# EAGLE board proto (EAGLE 5.10)
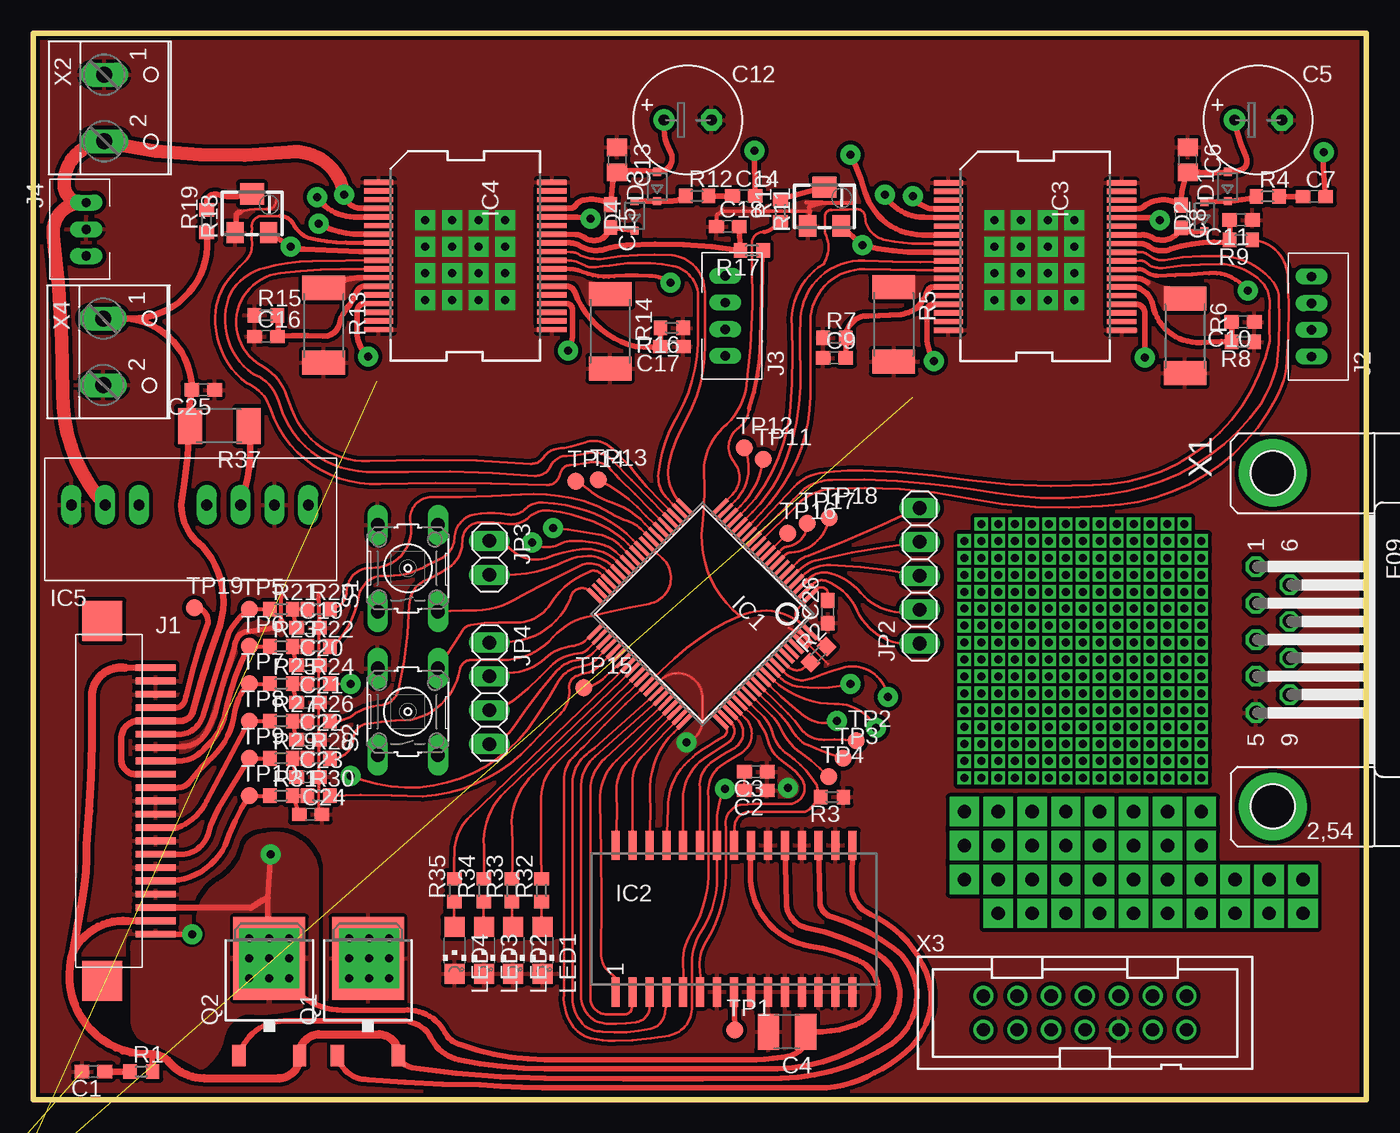
[diagram p2: board, top side]
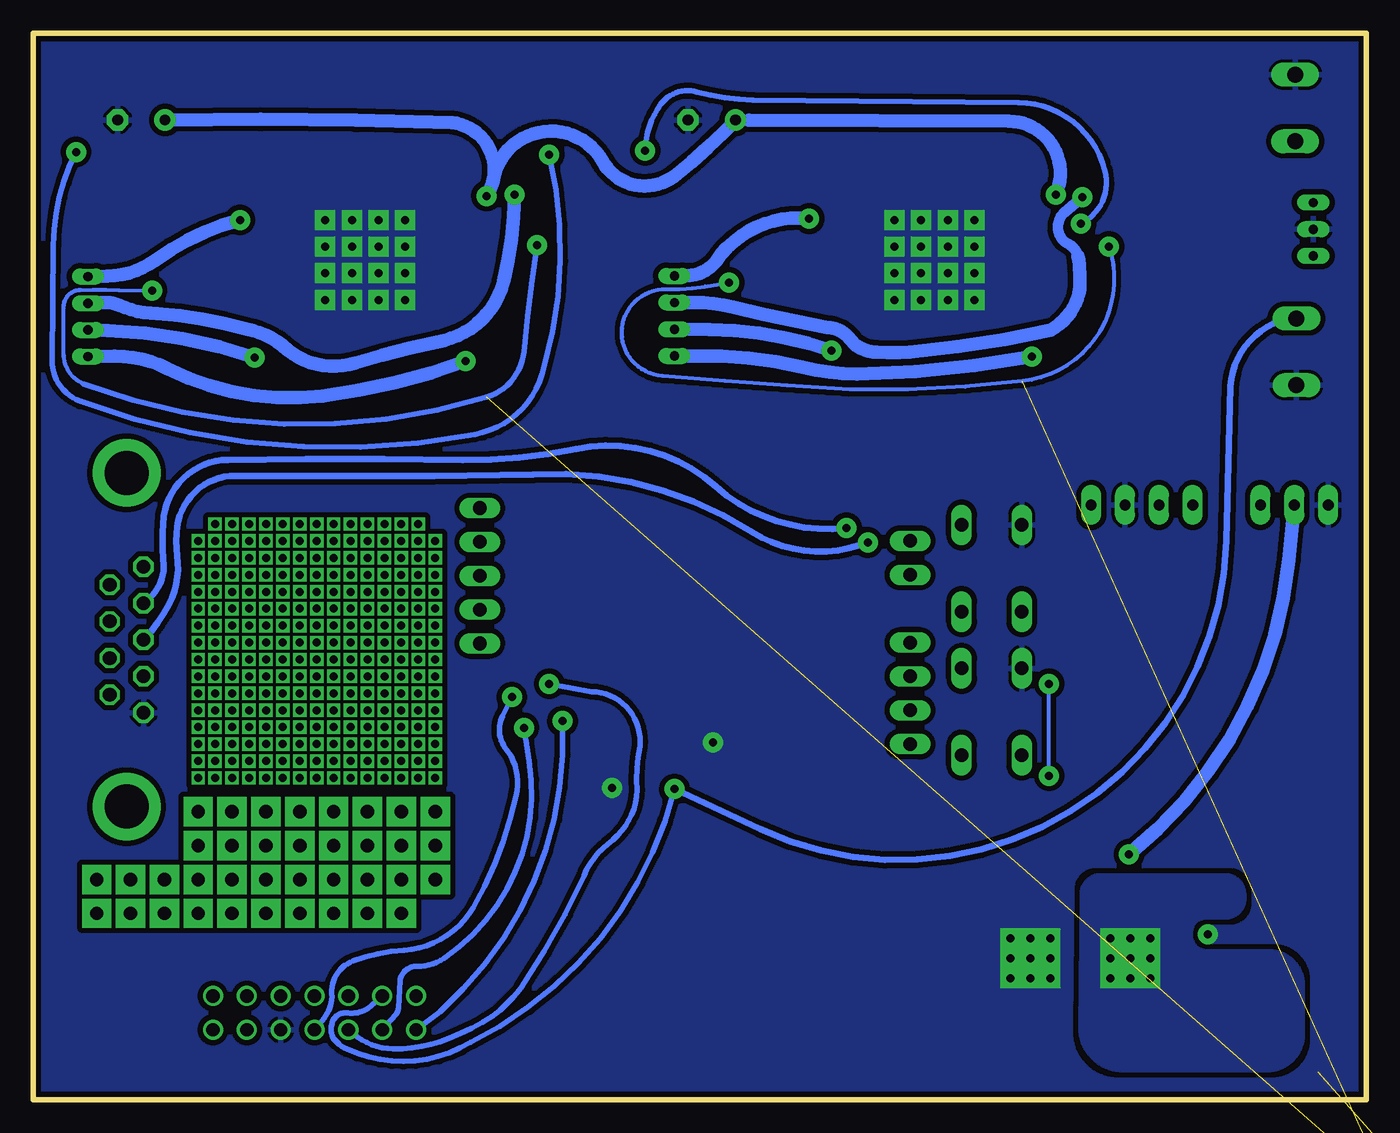
[diagram p3: board, bottom side, seen from below]

Size 100 x 80 mm. Coordinates in mm from the lower left corner, seen from the top.
Outline: 0,0 100,0 100,80 0,80 0,0
Copper layers (1*16): Top 0.035mm / dielectric 1.5mm / Bottom 0.035mm
Design rules "pcbtrain-express": minimum track width 0.2mm, minimum drill 0.5mm, track to track 0.2mm, track to pad 0.2mm, pad to pad 0.2mm, via to via 0.2mm, smd to smd 0.15mm, copper to edge 0.25mm, drill to drill 8mil, minimum pad ring 10mil, minimum via ring 8mil, stop-mask expansion 0.125mm, vias tented up to drill 0mil, thermal gap 10mil

## Footprints (pad centres in the part's own frame; a part is rotated, then mirrored left to right if it is on the bottom)
C0603 = smd 1.1 x 1: 1 -0.85,0; 2 0.85,0
C1210 = smd 1.6 x 2.7: 1 -1.4,0; 2 1.4,0
E3,5-8 = drill 0.813 pad 1.6 round: + -1.778,0 | drill 0.813 pad 1.6 octagon: - 1.778,0
C0805 = smd 1.3 x 1.5: 1 -0.95,0; 2 0.95,0
SOD323-R = smd 0.6 x 0.6: A 1.1,0; C -1.1,0
SQFP-S-12X12-80 = smd 0.3 x 1.6: 1 -4.75,-6.6; 2 -4.25,-6.6; 3 -3.75,-6.6; 4 -3.25,-6.6; 5 -2.75,-6.6; 6 -2.25,-6.6; 7 -1.75,-6.6; 8 -1.25,-6.6; 9 -0.75,-6.6; 10 -0.25,-6.6; 11 0.25,-6.6; 12 0.75,-6.6; 13 1.25,-6.6; 14 1.75,-6.6; 15 2.25,-6.6; 16 2.75,-6.6; 17 3.25,-6.6; 18 3.75,-6.6; 19 4.25,-6.6; 20 4.75,-6.6; 41 4.75,6.6; 42 4.25,6.6; 43 3.75,6.6; 44 3.25,6.6; 45 2.75,6.6; 46 2.25,6.6; 47 1.75,6.6; 48 1.25,6.6; 49 0.75,6.6; 50 0.25,6.6; 51 -0.25,6.6; 52 -0.75,6.6; 53 -1.25,6.6; 54 -1.75,6.6; 55 -2.25,6.6; 56 -2.75,6.6; 57 -3.25,6.6; 58 -3.75,6.6; 59 -4.25,6.6; 60 -4.75,6.6 | smd 1.6 x 0.3: 21 6.6,-4.75; 22 6.6,-4.25; 23 6.6,-3.75; 24 6.6,-3.25; 25 6.6,-2.75; 26 6.6,-2.25; 27 6.6,-1.75; 28 6.6,-1.25; 29 6.6,-0.75; 30 6.6,-0.25; 31 6.6,0.25; 32 6.6,0.75; 33 6.6,1.25; 34 6.6,1.75; 35 6.6,2.25; 36 6.6,2.75; 37 6.6,3.25; 38 6.6,3.75; 39 6.6,4.25; 40 6.6,4.75; 61 -6.6,4.75; 62 -6.6,4.25; 63 -6.6,3.75; 64 -6.6,3.25; 65 -6.6,2.75; 66 -6.6,2.25; 67 -6.6,1.75; 68 -6.6,1.25; 69 -6.6,0.75; 70 -6.6,0.25; 71 -6.6,-0.25; 72 -6.6,-0.75; 73 -6.6,-1.25; 74 -6.6,-1.75; 75 -6.6,-2.25; 76 -6.6,-2.75; 77 -6.6,-3.25; 78 -6.6,-3.75; 79 -6.6,-4.25; 80 -6.6,-4.75
SOP30 = smd 0.6 x 2.2: 1 -8.89,-5.5; 2 -7.62,-5.5; 3 -6.35,-5.5; 4 -5.08,-5.5; 5 -3.81,-5.5; 6 -2.54,-5.5; 7 -1.27,-5.5; 8 0,-5.5; 9 1.27,-5.5; 10 2.54,-5.5; 11 3.81,-5.5; 12 5.08,-5.5; 13 6.35,-5.5; 14 7.62,-5.5; 15 8.89,-5.5; 16 8.89,5.5; 17 7.62,5.5; 18 6.35,5.5; 19 5.08,5.5; 20 3.81,5.5; 21 2.54,5.5; 22 1.27,5.5; 23 0,5.5; 24 -1.27,5.5; 25 -2.54,5.5; 26 -3.81,5.5; 27 -5.08,5.5; 28 -6.35,5.5; 29 -7.62,5.5; 30 -8.89,5.5
POWERSO-36 = smd 0.4 x 2.2: 1 -5.525,-6.5; 2 -4.875,-6.5; 3 -4.225,-6.5; 4 -3.575,-6.5; 5 -2.925,-6.5; 6 -2.275,-6.5; 7 -1.625,-6.5; 8 -0.975,-6.5; 9 -0.325,-6.5; 10 0.325,-6.5; 11 0.975,-6.5; 12 1.625,-6.5; 13 2.275,-6.5; 14 2.925,-6.5; 15 3.575,-6.5; 16 4.225,-6.5; 17 4.875,-6.5; 18 5.525,-6.5; 19 5.525,6.5; 20 4.875,6.5; 21 4.225,6.5; 22 3.575,6.5; 23 2.925,6.5; 24 2.275,6.5; 25 1.625,6.5; 26 0.975,6.5; 27 0.325,6.5; 28 -0.325,6.5; 29 -0.975,6.5; 30 -1.625,6.5; 31 -2.275,6.5; 32 -2.925,6.5; 33 -3.575,6.5; 34 -4.225,6.5; 35 -4.875,6.5; 36 -5.525,6.5
IU-SIP = drill 0.8 pad 1.5 long: 1 -8.7,-1.04; 2 -6.16,-1.04; 3 -3.62,-1.04; 5 1.46,-1.04; 6 4,-1.04; 7 6.54,-1.04; 8 9.08,-1.04
FFC-21 = smd 3 x 0.5: 1 4,9.5; 2 4,8.5; 3 4,7.5; 4 4,6.5; 5 4,5.5; 6 4,4.5; 7 4,3.5; 8 4,2.5; 9 4,1.5; 10 4,0.5; 11 4,-0.5; 12 4,-1.5; 13 4,-2.5; 14 4,-3.5; 15 4,-4.5; 16 4,-5.5; 17 4,-6.5; 18 4,-7.5; 19 4,-8.5; 20 4,-9.5; 21 4,-10.5 | smd 3 x 3: P$1 0,-14; P$2 0,13
4-WAY-2MM = drill 0.7 long: 1 -3,0.5; 2 -1,0.5; 3 1,0.5; 4 3,0.5
3-WAY-2MM = drill 0.7 long: 1 -2,0.27; 2 0,0.27; 3 2,0.27
1X05 = drill 1.016 long: 1 -5.08,0; 2 -2.54,0; 3 0,0; 4 2.54,0; 5 5.08,0
1X02 = drill 1.016 long: 1 -1.27,0; 2 1.27,0
1X04 = drill 1.016 long: 1 -3.81,0; 2 -1.27,0; 3 1.27,0; 4 3.81,0
CHIPLED_1206 = smd 1.5 x 1.5: A 0,-1.75; C 0,1.75
DPACK_1 = smd 1 x 1.6: B -2.28,-4.8; E 2.28,-4.8 | smd 5.4 x 6.2: C 0,2.5
R0603 = smd 1 x 1.1: 1 -0.85,0; 2 0.85,0
R2512 = smd 1.8 x 3.2: 1 -2.8,0; 2 2.8,0
RTRIMTSM53YJ = smd 1.3 x 1.6: 1 -1.25,-1.45; 2 1.25,-1.45 | smd 1.8 x 1.6: 3 0,1.45
R2010 = smd 1.8 x 2.7: 1 -2.2,0; 2 2.2,0
B3F-10XX = drill 1.016 long: 1 -3.251,2.261; 2 3.251,2.261; 3 -3.251,-2.261; 4 3.251,-2.261
B1,27 = smd 1.27 x 1.27: TP 0,0
F09HP = drill 1.016 octagon: 1 -5.486,-1.27; 2 -2.743,-1.27; 3 0,-1.27; 4 2.743,-1.27; 5 5.486,-1.27; 6 -4.115,1.27; 7 -1.372,1.27; 8 1.372,1.27; 9 4.115,1.27 | drill 3.302 pad 5.08 round: G1 -12.522,0; G2 12.522,0
W237-102 = drill 1.194 long: 1 -2.5,-1.27; 2 2.5,-1.27
PAK100/2500-14 = drill 1 pad 1.422 round: 1 -7.62,-1.27; 2 -7.62,1.27; 3 -5.08,-1.27; 4 -5.08,1.27; 5 -2.54,-1.27; 6 -2.54,1.27; 7 0,-1.27; 8 0,1.27; 9 2.54,-1.27; 10 2.54,1.27; 11 5.08,-1.27; 12 5.08,1.27; 13 7.62,-1.27; 14 7.62,1.27

## Placement (x,y rotation side)
C1  15nF  [C0603]  4.5,2.1 180 top
C2  1nF  [C0603]  54.2,23.2 180 top
C3  100nF  [C0603]  54.2,24.6 180 top
C4  10uF 50V  [C1210]  56.55,5.1 180 top
C5  100uF  [E3,5-8]  91.9,73.5 0 top
C6  100nF  [C0805]  86.6,70.5 270 top
C7  10nF  [C0603]  96.1,67.75 0 top
C8  220nF  [C0603]  86.1,66.25 270 top
C9  1nF  [C0603]  60.1,55.65 0 top
C10  1nF  [C0603]  90.75,58.35 180 top
C11  5.6nF  [C0603]  90.6,66 180 top
C12  100uF  [E3,5-8]  49.1,73.5 0 top
C13  100nF  [C0805]  43.8,70.5 270 top
C14  10nF  [C0603]  53.3,67.8 0 top
C15  220nF  [C0603]  43.3,66.3 270 top
C16  1nF  [C0603]  17.45,57.25 0 top
C17  1nF  [C0603]  47.9,56.5 180 top
C18  5.6nF  [C0603]  52.1,65.5 0 top
C19  100pF  [C0603]  20.6,35.4 0 top
C20  100pF  [C0603]  20.6,32.6 0 top
C21  100pF  [C0603]  20.6,29.8 0 top
C22  100pF  [C0603]  20.6,27 0 top
C23  100pF  [C0603]  20.6,24.2 0 top
C24  100pF  [C0603]  20.8,21.4 0 top
C25  100nF  [C0603]  12.75,53.25 180 top
C26  100nF  [C0603]  59.6,36.6 90 top
C27  68nF  [C0603]  -6.35,-10.16 0 top  (outside the outline)
C28  68nF  [C0603]  -6.35,-15.24 0 top  (outside the outline)
D1  1N4148WS  [SOD323-R]  89.6,68.5 90 top
D2  1N4148WS  [SOD323-R]  87.85,66.25 90 top
D3  1N4148WS  [SOD323-R]  46.8,68.5 90 top
D4  1N4148WS  [SOD323-R]  45.1,66.3 90 top
IC1  MSP430F2618TPN  [SQFP-S-12X12-80]  50.21,36.43 135 top
IC2  E09A41RA  [SOP30]  52.57,13.57 0 top
IC3  L6228PD  [POWERSO-36]  75.15,63.25 270 top
IC4  L6228PD  [POWERSO-36]  32.4,63.3 270 top
IC5  IU4803SA  [IU-SIP]  11.55,45.65 0 top
J1  FFC-21  [FFC-21]  5.17,22.91 0 top
J2  [4-WAY-2MM]  96.4,58.75 90 top
J3  [4-WAY-2MM]  52.4,58.8 90 top
J4  PINHD-1X3-2MM  [3-WAY-2MM]  3.7,65.3 270 top
JP2  [1X05]  66.5,39.3 90 top
JP3  [1X02]  34.22,40.64 270 top
JP4  [1X04]  34.22,30.48 270 top
LED1  [CHIPLED_1206]  38.2,11.2 180 top
LED2  [CHIPLED_1206]  36,11.2 180 top
LED3  [CHIPLED_1206]  33.8,11.2 180 top
LED4  [CHIPLED_1206]  31.6,11.2 180 top
Q1  2SA2192  [DPACK_1]  25.1,8.1 0 top
Q2  2SC6017  [DPACK_1]  17.7,8.1 0 top
R1  2R2  [R0603]  8.1,2.1 0 top
R2  1k  [R0603]  58.9,33.4 45 top
R3  1k  [R0603]  59.93,22.69 180 top
R4  100R  [R0603]  92.6,67.75 0 top
R5  560mR  [R2512]  64.55,58.17 270 top
R6  560mR  [R2512]  86.4,57.3 270 top
R7  39k  [R0603]  60.1,57.15 0 top
R8  39k  [R0603]  90.75,56.85 180 top
R9  100k  [R0603]  90.6,64.5 180 top
R10  27k  [R0603]  56.05,66.7 90 top
R11  10k  [RTRIMTSM53YJ]  59.35,67 0 top
R12  100R  [R0603]  49.8,67.8 0 top
R13  560mR  [R2512]  21.77,58.1 270 top
R14  560mR  [R2512]  43.27,57.65 270 top
R15  39k  [R0603]  17.45,58.85 0 top
R16  39k  [R0603]  47.9,57.9 180 top
R17  100k  [R0603]  53.9,63.7 180 top
R18  10k  [RTRIMTSM53YJ]  16.4,66.5 0 top
R19  27k  [R0603]  13,65.9 90 top
R20  100R  [R0603]  21.4,36.8 0 top
R21  100R  [R0603]  18.6,36.8 0 top
R22  100R  [R0603]  21.4,34 0 top
R23  100R  [R0603]  18.6,34 0 top
R24  100R  [R0603]  21.4,31.2 0 top
R25  100R  [R0603]  18.6,31.2 0 top
R26  100R  [R0603]  21.4,28.4 0 top
R27  100R  [R0603]  18.6,28.4 0 top
R28  100R  [R0603]  21.4,25.6 0 top
R29  100R  [R0603]  18.6,25.6 0 top
R30  100R  [R0603]  21.4,22.8 0 top
R31  100R  [R0603]  18.6,22.8 0 top
R32  150R  [R0603]  38.13,15.71 90 top
R33  150R  [R0603]  35.91,15.71 90 top
R34  150R  [R0603]  33.8,15.71 90 top
R35  150R  [R0603]  31.58,15.71 90 top
R37  LINK  [R2010]  13.95,50.55 180 top
S1  [B3F-10XX]  28.1,39.86 90 top
S2  [B3F-10XX]  28.1,29.1 90 top
TP1  TPB1,27  [B1,27]  52.63,5.21 0 top
TP2  TPB1,27  [B1,27]  61.75,26.91 0 top
TP3  TPB1,27  [B1,27]  60.77,25.61 0 top
TP4  TPB1,27  [B1,27]  59.69,24.21 0 top
TP5  TPB1,27  [B1,27]  16.2,36.8 0 top
TP6  TPB1,27  [B1,27]  16.2,34 0 top
TP7  TPB1,27  [B1,27]  16.2,31.2 0 top
TP8  TPB1,27  [B1,27]  16.2,28.4 0 top
TP9  TPB1,27  [B1,27]  16.2,25.6 0 top
TP10  TPB1,27  [B1,27]  16.2,22.8 0 top
TP11  TPB1,27  [B1,27]  54.75,48.05 0 top
TP12  TPB1,27  [B1,27]  53.35,48.9 0 top
TP13  TPB1,27  [B1,27]  42.4,46.5 0 top
TP14  TPB1,27  [B1,27]  40.7,46.4 0 top
TP15  TPB1,27  [B1,27]  41.3,30.9 0 top
TP16  TPB1,27  [B1,27]  56.6,42.5 0 top
TP17  TPB1,27  [B1,27]  58.05,43.25 0 top
TP18  TPB1,27  [B1,27]  59.7,43.65 0 top
TP19  TPB1,27  [B1,27]  12.1,36.9 0 top
X1  [F09HP]  93,34.5 270 top
X2  [W237-102]  6.6,74.4 270 top
X3  2514-  [PAK100/2500-14]  78.9,6.5 0 top
X4  [W237-102]  6.5,56.1 270 top

## Tracks (layer width: path | path; a pad name or v marks a point on that pad's centre or on a via)
!RST
  Top 0.2: IC2.6 arc9 50,9.7 arc-37 50.5,11.9 arc31 51.95,16.9 51.95,20.45 arc-83 53,22.1 arc-9 54.7,22.2 arc3 56.9,22.2 arc110 57.7,24 arc22 56.3,25.3 arc-38 55.2,26.7 arc21 54.4,28.4 IC1.65
+3V3  (via drill 0.6 pad 1.5)
  Top 0.2: 53,36.3 arc19 48.1,33.1 IC1.52 arc4 41.3,26.5 arc-4 40.6,25.8 arc46 39.8,24 39.8,7.9 arc34 40.4,5.6 arc41 41.8,4.6 arc15 43.6,4.4 arc11 47.7,4.8 arc83 49.4,7 49.4,10.2 arc-33 50.1,12.6 arc27 51.3,16.1 IC2.24 51.3,20.5 arc-34 v51.9,23.3 C2.2 C3.2 | 53,36.3 arc-73 IC1.80 | IC1.80 arc16 57.5,35.8 arc-100 57.4,36.9 IC1.1 arc0 58.8,38.3 arc-130 59.6,38 arc-8 C26.2 | R2.2 59.5,34.1 arc53 59.7,34.2 arc-49 58.7,34.7 arc17 IC1.80 | 54.8,65.1 arc90 53.9,64.2 53.9,62.8 arc-11 53.45,53.27 arc-35 52.05,50.67 arc50 50.3,47.2 arc-11 50.2,43.1 arc58 53,36.3
  Top 0.3: R10.1 55.5,65.4 arc-32 54.8,65.1
  Top 0.4: 11.7,50.2 arc30 R37.2
  Top 0.5: J1.9 arc-90 J1.9 7.7,24.4 arc-90 6.6,25.5 6.6,27.1 arc-90 7.91,28.41 J1.5 arc-1 10.9,28.4 arc84 12,29.2 arc-7 14,35.6 arc58 12.7,41.5 arc-54 11.1,44.6 arc7 11.7,50.2 | R37.2 arc-20 C25.2 arc91 6.6,58.6 | 6.6,58.6 X4.1 | 6.6,58.6 7.4,58.6 arc98 R19.1
  Bottom 0.3: v51.9,23.3 51.9,22.7
  Bottom 0.4: X3.4 74.7,7 arc50 76.4,6.5 arc-84 77.6,5.7 arc-43 77.5,4.6 arc-28 76.5,3.8 arc-57 67.2,4.3 arc-50 v51.9,23.3
  Bottom 0.5: v51.9,23.3 45.5,20.3 arc-114 10.5,41.9 10.2,53.5 arc77 5.4,58.7 arc146 X4.1
CH
  Top 0.3: TP6.TP R23.1
  Top 0.4: J1.8 10.9,25.4 arc51 12.8,26.3 arc34 14.3,28.6 arc-13 15.6,32.8 arc-2 TP6.TP
CH_M
  Top 0.2: IC1.30 45,42 arc31 40.8,44.4 arc11 38.2,44.8 arc49 36.9,44.3 arc-56 35.6,43.9 arc22 33.1,43.9 arc78 31.6,42.1 arc-60 30.6,40.6 arc1 29.2,39.9 arc-31 26.2,39.3 arc77 24.4,37.7 arc-33 22.6,34.1 arc13 R22.2
CK
  Top 0.3: TP8.TP R27.1
  Top 0.4: J1.13 10.8,20.4 arc45 13,22.4 TP8.TP
CK_M
  Top 0.2: IC1.31 44.6,41.7 arc19 42.8,43 arc20 38.7,44.2 arc50 37.2,43.7 arc-52 35.6,43.2 arc10 34,43.3 arc-3 33.6,43.3 arc93 32.2,41.9 arc-58 31,39.8 arc-10 29.5,39 arc65 28.2,37.1 arc-11 27.4,30.8 arc-69 26.2,29.6 arc34 23.9,28.8 arc-40 R26.2
CLOCK1
  Top 0.2: IC1.16 53.95,44.1 arc26 56.55,48.2 arc22 57.55,54.85 arc-5 57.55,58.6 arc-89 62.35,62.95 arc7 IC3.10
CLOCK2
  Top 0.2: IC1.24 arc1 43.4,48 arc56 41.6,48.5 arc-11 40,48.3 arc64 38.8,47.5 arc-71 37.6,46.8 arc7 28.1,47.1 arc-3 25,47.1 arc-64 18.9,51.1 arc-9 18.4,52.4 arc53 16.5,54.45 arc-80 14.85,60.6 arc-43 17.3,62.4 arc-14 20.9,62.9 IC4.10
CONTROL1
  Top 0.2: IC3.28 83,63.6 arc-39 83.6,63.4 arc14 84.1,63.1 arc34 84.9,63 arc-11 89,63.3 arc-52 93.05,61.3 arc-35 93.45,60.2 arc-8 93.3,55.05 arc-17 92.1,52.2 arc-49 80.7,45.45 arc-19 72.2,45.5 arc3 67.3,46.2 arc8 59.9,46.5 arc24 58.3,46.1 arc19 57.6,45.6 arc0 55.9,43.9 IC1.13
CONTROL2
  Top 0.2: IC4.28 40.3,63.6 arc-28 40.85,63.45 arc39 42.8,63.1 arc-13 47.9,63.35 arc-86 50.38,60.6 arc-1 50.38,56.6 arc-30 49,51.05 arc17 47.7,47.75 arc66 IC1.21
D0
  Top 0.2: IC1.54 42.1,26.4 arc-2 41.5,25.9 arc55 40.45,23.5 40.45,7.65 arc48 41.4,5.5 arc35 42.7,5.1 arc18 46.3,5.3 arc74 47.4,6.6 arc12 47.5,7.65 arc1 IC2.4
D1
  Top 0.2: IC1.55 42.15,25.75 arc51 41.1,23.35 41.1,7.75 arc35 41.5,6.5 arc53 43,5.7 arc8 45.2,5.8 arc99 46.2,7.3 arc5 IC2.3
D2
  Top 0.2: IC1.56 42.9,25.6 arc41 41.8,23.5 41.8,7.6 arc90 43,6.4 44.4,6.4 arc90 44.9,6.9 arc-8 44.95,7.65 arc-4 IC2.2
D3
  Top 0.2: IC1.57 43.75,25.45 arc48 42.5,22.4 arc-2 42.6,10.95 arc57 43.45,9.35 arc-92 IC2.1
D4
  Top 0.2: IC1.58 44.7,25.5 arc50 43.75,22.95 arc-8 IC2.30
D5
  Top 0.2: IC1.59 45.8,25.9 arc46 44.95,23.8 arc-2 IC2.29
D6
  Top 0.2: IC1.60 48.05,27.55 arc48 46.25,22.9 arc-7 IC2.28
D7
  Top 0.2: IC1.61 51.9,28.05 arc-106 51.8,27.25 arc0 50.1,26.2 arc10 49.5,25.7 arc54 47.6,21.85 IC2.27
D8
  Top 0.2: IC1.62 52.3,28.35 arc-102 52.15,26.8 arc-1 50.55,25.75 arc63 48.75,22.25 IC2.26
D9
  Top 0.2: IC1.63 52.85,28.5 arc-102 52.65,26.4 arc6 50.8,25.25 arc54 50,23.45 IC2.25
DACLAT
  Top 0.2: IC1.64 53.4,28.65 arc-99 53.2,26.05 arc2 51.5,25 arc57 50.65,22.7 50.65,17.35 arc-33 49.35,12.5 arc35 48.75,10.2 arc-5 IC2.5
DAOUT
  Top 0.4: TP1.TP IC2.8
DIR1
  Top 0.2: IC1.15 arc12 53.95,43.35 arc8 55.75,45.4 arc36 58.3,52.75 arc2 58.3,58.4 arc-90 62.35,62.3 arc3 68.25,62.25
  Top 0.3: 68.25,62.25 arc4 IC3.11
DIR2
  Top 0.2: IC1.23 46,46 arc-5 44.8,47.45 arc1 43.5,48.8 arc65 41.4,49.3 arc-10 39.8,48.9 arc1 39.2,48.8 arc48 38.3,48.2 arc-62 37.3,47.7 arc7 25.2,47.9 arc-67 19.6,51.3 arc-6 19,52.8 arc43 17.05,55.1 arc-142 18.5,62 arc-6 23.1,62.3 IC4.11
DRIVE
  Top 0.4: IC2.18 59,14.9 arc72 59.9,13.7 arc-18 64.5,11.4 arc-108 64.4,4.2 arc-33 56.1,1.6 arc-1 38.4,1.6 arc-8 28.4,2.4 arc-76 27.5,3.3 arc-2 Q1.E | R1.2 8.9,2.1 8.9,3.4 | 8.9,3.4 8,3.4 | 8.9,3.4 9,3.4
  Top 0.5: 7.1,13.4 arc1 J1.20 | 6.9,32.4 J1.1
  Top 0.6: Q1.E arc90 25.98,4.9 21.38,4.9 arc90 Q2.E arc-93 18.4,1.6 arc-1 12.8,1.6 arc-49 10.2,2.8 arc49 8.9,3.4 | 9,3.4 arc-112 3,11.1 | 3,11.1 arc-68 7.1,13.4 | 3,11.1 3.7,15.1 arc12 4,19.1 arc4 4.4,26.7 arc2 4.4,30.2 arc-99 6.9,32.4
EN1
  Top 0.2: R9.1 arc-83 94.1,61.85 arc-8 94,54.9 arc-19 93.3,52.7 arc-62 80.2,44.55 arc-17 70.2,45.1 arc16 59.8,45.8 arc41 57.4,44.7 IC1.12
EN2
  Top 0.2: IC1.20 52.45,45.4 arc82 52.6,47.8 arc-92 52.8,50.3 arc47 53.7,51.8
  Top 0.3: R17.1 54.6,56.9 arc-17 53.7,51.8
GND  (via drill 0.6 pad 1.5)  (2 unrouted)
  Top 0.2: C24.2 21.4,21.9 | 21.4,21.9 21.4,37.5 | 21.4,21.9 C23.2 C22.2 | C19.2 C20.2 | 15.5,66.6 arc-17 17,66.8 arc2 17.6,66.8 arc97 18.2,67.5 | IC1.53 47.1,31.5 arc-134 50.2,30.1 arc3 50.2,28.6 arc-78 v49,26.8 | 56.7,35.4 IC1.79 58.2,34.1 59.6,32.7
  Top 0.3: 21.4,38 21.4,37.5 C19.2 | 18.6,36 18.6,37.8 | 59.2,67.3 58,67.3 | 59.2,67.3 61.6,67.3 | 58.28,66.67 R11.1 | 58.28,66.67 58.2,67 59.2,67.3 | C18.1 51.3,66.4 51.7,66.7 58.28,66.67
  Top 0.4: J1.7 11.2,26.5 arc70 13.1,27.8 arc14 13.8,29.6 arc-10 14.7,32.6 arc7 15.1,34 arc-22 15.3,34.6 arc-57 16,35.1 18,35.4 arc90 18.6,36 | R18.1 15.2,65.05 15.2,66.2 arc-74 15.5,66.6 | J1.21 v11.9,12.4
  Bottom 0.3: v49,26.8 arc64 48.7,26.7
  Bottom 0.4: v11.9,12.4 arc67 12.2,12.6
  other vias: 56.6,23.4 29.4,66 31.4,66 33.4,66 35.4,66 35.4,64 33.4,64 31.4,64 29.4,64 29.4,62 29.4,60 31.4,60 31.4,62 33.4,62 33.4,60 35.4,60 35.4,62 72.1,66 74.1,66 76.1,66 78.1,66 78.1,64 76.1,64 74.1,64 72.1,64 72.1,62 72.1,60 74.1,60 74.1,62 76.1,62 76.1,60 78.1,60 78.1,62 23.7,12.1 25.2,12.1 26.7,12.1 26.7,10.6 25.2,10.6 23.7,10.6 23.7,9.1 25.2,9.1 26.7,9.1
  pour Top (isolate 0.3, rank 5): -8,84.5 103,84.5 103,-3.5 -8,-3.5
  pour Bottom (isolate 0.4, rank 6): -7.7,86.4 105.6,86.4 105.6,-6.6 -7.7,-6.6
HF1
  Top 0.2: IC3.27 83,62.95 arc-42 83.55,62.75 arc48 84.7,62.4 arc-6 89,62.7 arc-42 92.1,61.4 arc-49 92.75,59.75 arc6 92.75,56.9 arc-78 79.5,46.1 arc-12 70.1,46.5 arc7 62.2,47.2 arc11 59,47 arc38 57.1,46 IC1.14
HF2
  Top 0.2: IC4.27 40.2,62.95 arc-30 41.25,62.65 arc38 42.2,62.45 arc1 43.75,62.65 arc-18 48,62.55 arc-81 49.88,60.1 arc2 49.88,57.65 arc-32 48.35,51.35 arc24 46.9,47 arc52 47.6,45.05 arc-2 IC1.22
LAT
  Top 0.3: TP7.TP R25.1
  Top 0.4: J1.10 10.8,23.4 arc49 11.7,23.8 arc-7 13.1,25.4 arc44 15.1,29.1 arc-36 TP7.TP
LAT_M  (via drill 0.6 pad 1.5)
  Top 0.2: v23.8,24.3 arc75 37.1,27.8 arc8 39.4,31.4 arc-51 41.1,32.5 arc38 42.2,33 IC1.44 | R24.2 23.2,31.2 arc-35 v23.8,31.2
  Bottom 0.3: v23.8,24.3 v23.8,31.2
MSPRX  (via drill 0.6 pad 1.5)
  Top 0.2: IC1.33 43.7,41.1 arc27 42.8,41.6 arc18 40.6,41.9 arc28 39.5,41.7 arc-65 v37.4,41.8
  Bottom 0.3: v37.4,41.8 arc-8 37.5,41.9
  Bottom 0.5: v37.4,41.8 38,41.6 arc51 46.1,42.6 arc-36 62.5,46.9 arc2 84.8,46.8 arc-83 89.2,43 arc-16 89.2,40.8 arc35 89.8,37.2 arc18 X1.3
MSPTX  (via drill 0.6 pad 1.5)
  Top 0.2: IC1.32 44.1,41.5 arc35 42.4,42.4 arc4 v39,42.9
  Bottom 0.3: v39,42.9 arc13 38.9,42.9
  Bottom 0.5: v39,42.9 arc48 48.8,46 arc-54 59.3,48.8 arc13 67.8,48 arc-2 85.4,48 arc-80 90.2,43.8 arc-11 90.2,40 arc53 X1.2
N$1
  Top 0.4: IC2.20 56.5,14.7 arc76 58,12.9 arc-16 63.2,11 arc-118 63.4,4.9 arc-35 55.8,2.3 38.4,2.3 arc-12 31.9,3 arc-57 29.7,4.9 arc58 27.2,5.9 18.8,5.9 arc73 Q2.B
N$2
  Top 0.2: IC1.67 55.4,28.8 arc-21 56.1,27.8 arc31 57.6,26 arc-12 TP4.TP
N$3
  Top 0.4: IC2.16 61.4,16.1 arc67 62.8,13.9 arc-45 67,9.5 arc-65 65.9,4 arc-21 63.1,2 arc-27 59.5,0.9 38.2,0.9 arc-5 33.5,1.1 arc-6 25.1,1.5 arc-80 Q1.B
N$4
  Top 0.5: C1.1 R1.1
N$5
  Top 0.2: IC1.68 56,28.9 arc-16 57,27.6 arc36 58.1,26.6 arc8 TP3.TP
N$6
  Top 0.2: IC1.69 56.1,29.5 arc-8 57.6,27.8 arc55 59.3,27 arc-8 TP2.TP
N$7
  Top 0.4: D2.C arc-4 86.3,65.1 arc-90 86.1,65.3 C8.2 arc-97 83.9,64.7 arc39 83.1,64.88 IC3.30
N$8
  Top 0.2: IC1.74 56.6,32.5 arc71 57.7,32.3 arc7 R2.1
N$9  (via drill 0.6 pad 1.5)
  Top 0.4: IC3.7 66.7,64.88 arc-74 62.4,68.1 arc10 v61.3,70.9 | v96.8,71.1 arc9 C7.2
  Bottom 0.4: v96.8,71.1 arc-26 98.5,64.1 98.6,55.5 arc-69 96.5,52.4 arc-31 66.9,49.9 arc-69 61.7,55 arc-30 v61.3,70.9
N$10
  Top 0.4: IC3.24 82.53,60.98 arc-38 83.1,60.8 arc-8 83.5,60.5 arc-35 84,59.6 arc82 87.6,56.8 arc-4 R8.2 C10.2
N$11
  Top 0.4: R4.2 C7.1
N$12
  Top 0.4: D2.A D1.C arc15 R4.1
N$13
  Top 0.4: R10.2 R11.3
N$14
  Top 0.4: C9.2 R7.2 arc-90 62.6,58.8 arc5 65.1,58.9 arc5 65.65,59.05 arc38 66.62,59.8 arc12 67.12,60.73 arc-64 67.53,60.98 IC3.13
N$15
  Top 0.4: R5.1 64.4,61.62
  pour Top (no thermals): 67.92,61.62 arc-4 66.08,61.67 arc20 65.38,61.6 arc167 65.6,60.27 arc-7 66.12,60.27 arc67 66.4,60.58 arc-10 66.62,61.15 arc-53 67.25,61.6 arc0 67.55,61.62
N$16
  Top 0.4: R6.1 arc-55 86.7,60.4 | IC3.25 82.78,61.62 arc-34 83.6,61.3
  pour Top (rank 2, no thermals): 83.45,61.4 84.4,61 arc15 86.75,60.8 arc-183 86.7,59.4 arc3 85.6,59.4 84.85,59.4 arc-18 84.5,60.2 arc32
N$17
  Top 0.4: R9.2 89.75,64.22 | R9.2 C11.2 | IC3.29 82.9,64.22 arc-41 83.7,64 arc58 85.3,63.8 arc-21 89.4,64.3 arc-1 R9.2
N$18  (via drill 0.6 pad 1.5)  (1 unrouted)
  Top 0.3: IC3.26 82.9,62.3 arc-39 83.5,62.1 arc39 84.4,61.8 arc4 88.2,62 arc-58 v91.1,60.7
  Top 0.4: IC3.9 65.6,63.58 arc-10 v62.2,64.1 R11.2
  Bottom 0.3: 91.2,60.5 arc20 v91.1,60.7 | 91.2,60.7 93.58,60.73 arc-4 96.47,60.75 arc-86 97.7,59.6 arc-4 97.7,55.8 arc-67 96.2,53.7
  Bottom 0.4: 61.7,64 arc16 v62.2,64.1 arc-2 63.2,56.1 arc67 66,52.7 arc38 96.2,53.7
  Bottom 0.6: 91.2,60.7 91.2,60.5
N$19
  Top 0.2: IC1.18 53.05,44.55 arc40 TP11.TP
N$20  (via drill 0.6 pad 1.5)
  Top 0.4: IC4.7 24.57,64.92 arc-27 v21.4,65.7 | v54.1,71.2 C14.2
  Bottom 0.4: v54.1,71.2 arc36 52.9,74.7 arc69 50.2,75.6 arc-16 46,75 26.1,74.8 arc75 19.6,69.7 arc77 v21.4,65.7
N$21
  Top 0.4: R12.2 C14.1
N$22
  Top 0.4: D4.A D3.C 47.8,67.4 arc38 R12.1
N$23
  Top 0.4: IC4.12 24.88,61.67 arc28 R13.1
  pour Top (no thermals): 23.77,61.65 25,61.67 arc61 23.77,60.98 arc4 23.38,60.2 22.8,60.2 arc-180 22.8,61.6 arc4
N$24
  pour Top (no thermals): 38.92,61.67 40.1,61.67 arc-26 41.4,61.38 arc27 42.42,61.15 arc-75 43.2,60.58 arc-112 42.5,59.75 arc13 42.33,59.75 41.75,59.75 41.7,59.85 arc3 41.12,61.12 arc60 40.38,61.65
N$25
  Top 0.4: IC4.24 40,61.02 arc-72 40.62,60.58 arc56 45.2,56.5 arc11 C17.2 R16.2
N$26
  Top 0.4: 18.3,58.8 R15.2 arc-24 C16.2 arc-11 21.73,57.27 arc80 22.93,58.12 arc-27 23.73,59.62 arc22 24.23,60.55 arc-71 24.93,61.02 IC4.13
N$27
  Top 0.4: IC4.30 40.7,64.9 arc-35 41.3,64.7 arc113 C15.2 D4.C
N$28
  Top 0.4: C18.2 R17.2 arc13 44.5,64.1 arc13 42.9,63.8 arc-47 41.1,64 arc35 40.23,64.28 IC4.29
N$29
  Top 0.4: R19.2 13,67.3 arc-106 13.8,67.9 arc35 R18.3
N$30  (via drill 0.6 pad 1.5)  (1 unrouted)
  Top 0.3: IC4.26 40.3,62.3 arc-23 41.2,62.1 arc30 43.6,61.77 arc-7 46.2,61.8 arc-32 v47.8,61.3
  Top 0.4: IC4.9 24.48,63.62 20.3,63.8 arc-18 v19.3,64 R18.2
  Bottom 0.3: 47.5,61.2 v47.8,61.3 49.6,61 arc11 52.5,60.8 arc-178 52.8,54.3 arc-1 38.73,53.27 arc-8 25.8,53.9 arc-102 v19.3,64
  Bottom 0.4: v19.3,64 arc-13 19.1,64.1
N$31
  Top 0.2: IC1.19 52.65,44.9 arc69 TP12.TP
N$32
  Top 0.3: R20.1 R21.2 C19.1
N$33
  Top 0.3: C20.1 R23.2 R22.1
N$34
  Top 0.3: R24.1 R25.2 C21.1
N$35
  Top 0.3: R26.1 R27.2 C22.1
N$36
  Top 0.3: R28.1 R29.2 C23.1
N$37
  Top 0.3: R30.1 R31.2 C24.1
N$38
  Top 0.2: IC1.27 45.9,43.2 arc29 43.4,44.8 arc-26 41.6,45.8 arc17 TP14.TP
N$39
  Top 0.2: IC1.26 45.95,43.8 arc23 TP13.TP
N$40
  Top 0.2: R32.1 38.13,13.02 arc90 LED1.A
N$41
  Top 0.2: R33.1 35.91,13.04 arc90 LED2.A
N$42
  Top 0.2: R34.1 LED3.A arc90 LED3.A
N$43
  Top 0.2: R35.1 31.58,12.97 arc90 LED4.A
N$44
  Top 0.2: IC1.51 39.1,25.1 arc43 38.1,22.7 arc2 R32.2
N$45
  Top 0.2: IC1.50 37.5,24.4 arc49 35.9,20.4 arc-5 R33.2
N$46
  Top 0.2: IC1.49 35.4,23.1 arc50 33.8,19 arc-7 R34.2
N$47
  Top 0.2: IC1.48 32.8,21.3 arc45 31.6,18.6 arc2 R35.2
N$48
  Top 0.2: IC1.36 43.1,39.6 arc77 40.9,40 arc1 36.6,37.8 arc-33 33.2,36.7 arc1 S1.3
N$49
  Top 0.2: IC1.37 42.5,39.5 arc71 41.7,39.6 arc36 38.8,37.2 arc-65 36,35.8 arc12 32.8,35.6 arc49 32.2,35.2 arc-2 S2.4
N$50
  Top 0.4: J1.4 10.7,29.4 arc68 11.3,29.8 arc7 11.5,30.4 arc-7 13.1,35.8 arc95 TP19.TP
N$51  (via drill 1 pad 2.2)
  other vias: 87.63,13.97
N$53
  Top 0.2: IC1.2 58.5,38.7 arc-66 59.5,38.9 arc-44 61.8,36.7 arc75 JP2.1
N$54
  Top 0.2: IC1.3 58.2,39.1 arc-59 59.7,39.5 arc-35 62.1,38 arc68 JP2.2
N$55
  Top 0.2: IC1.4 57.7,39.3 arc-46 59.8,40.1 arc-10 JP2.3
N$56
  Top 0.2: IC1.5 57.4,39.7 arc-31 58.9,40.5 arc-5 JP2.4
N$57
  Top 0.2: IC1.6 57.3,40.3 arc-23 58.1,40.8 arc6 66.4,44.4 arc-75 JP2.5
  Bottom 0.5: JP2.5 66.5,44.5 66.5,44.6
N$60
  Top 0.2: IC1.40 41.8,38.1 arc130 40.3,37.6 arc-82 34.2,34.5 JP4.1
N$61
  Top 0.2: IC1.41 41.4,34.4 arc-32 40.2,34 arc32 38.4,33.1 arc-42 35.7,32 arc10 34.2,31.7 arc-256 JP4.2
N$62
  Top 0.2: IC1.42 41.6,33.8 arc-40 41.1,33.5 arc19 39.8,33.2 arc21 38.8,32.5 arc-9 36.2,30.1 arc-28 JP4.3
N$63
  Top 0.2: IC1.43 42,33.5 arc-39 40.9,33 arc39 39.3,32.2 arc7 36,27.9 arc-42 JP4.4
N$64
  Top 0.2: IC1.47 42.9,31.7 arc-36 TP15.TP
N$65
  Top 0.2: IC1.34 43.8,40.4 arc47 41.2,41.3 arc17 38.4,40.6 arc-63 35.7,41.4 arc64 JP3.1
N$66
  Top 0.2: IC1.35 43.7,39.8 arc45 41.6,40.8 arc27 39.3,40.1 arc-26 34.6,39.4 arc12 JP3.2
N$67  (via drill 0.6 pad 1.5)
  Top 0.4: IC3.15 67.55,59.67 arc90 67.05,59.17 67.05,57.25 arc32 v67.58,55.4
  Bottom 1: J2.1 93.9,55.77 arc28 89.95,54.85 arc-34 78.28,52.8 arc-13 v67.58,55.4
N$68  (via drill 0.6 pad 1.5)
  Top 0.4: IC3.5 66.8,66.2 arc-62 v63.9,67.9
  Bottom 0.6: v63.9,67.9 arc-34 63.8,67.9
  Bottom 1: v63.9,67.9 arc15 64.72,61.38 arc67 69.7,56.85 arc-3 75.85,55.27 arc57 80.92,56.25 arc-33 84,57.8 arc-12 90.7,58.98 arc25 93.58,59.6 arc-26 95,59.8 J2.3
N$69  (via drill 0.6 pad 1.5)
  Top 0.4: IC3.22 82.72,59.67 arc-90 83.4,59 v83.4,55.66
  Bottom 1: J2.2 94.42,57.7 arc17 v83.4,55.66
N$70  (via drill 0.6 pad 1.5)
  Top 0.4: IC3.32 84.3,66.17 v84.5,66
  Bottom 1: J2.4 94.47,61.77 arc-35 90.83,63 arc21 v84.5,66
N$71  (via drill 0.6 pad 1.5)
  Top 0.4: IC4.5 24.07,66.22 arc-56 v21.3,67.7
  Bottom 0.8: v21.3,67.7 22.6,66.6 arc-114 22.32,64.17 arc51 21.62,63.27
  Bottom 1: J3.3 50.45,59.8 arc14 47.5,59.45 arc-3 40.42,57.92 arc50 38.73,57.08 arc-58 36.75,56.1 arc-10 34.23,56.1 arc-8 23.65,57.75 arc-69 21.5,62.02 arc-14 21.62,63.27
N$72  (via drill 0.6 pad 1.5)
  Top 0.4: IC4.22 40,59.73 arc-90 40.45,59.27 40.45,57.25 arc-19 v40.12,56.19
  Bottom 1: J3.2 49.27,57.77 arc19 v40.12,56.19
N$73  (via drill 0.6 pad 1.5)
  Top 0.4: IC4.32 40.27,66.22 arc-9 v41.8,66.1
  Bottom 1: J3.4 50.83,61.83 arc-48 48.8,62.88 arc62 v41.8,66.1
N$74  (via drill 0.6 pad 1.5)
  Top 0.4: IC4.15 24.85,59.73 arc90 24.3,59.17 24.3,57.52 arc49 v25.1,55.75
  Bottom 1: J3.1 50.4,55.8 arc13 42.33,54.98 arc-14 38.2,54.42 arc-10 v25.1,55.75
N$75
  Top 0.2: IC1.10 TP16.TP
N$76
  Top 0.2: IC1.9 56.1,41.25 arc-36 56.6,41.5 arc84 TP17.TP
N$77
  Top 0.2: IC1.8 56.4,40.85 arc-42 56.85,41.05 arc79 TP18.TP
N$92  (via drill 0.6 pad 1)
  other vias: 71.12,43.18
N$93  (via drill 0.6 pad 1)
  other vias: 72.39,43.18
N$94  (via drill 0.6 pad 1)
  other vias: 73.66,43.18
N$95  (via drill 0.6 pad 1)
  other vias: 74.93,43.18
N$96  (via drill 0.6 pad 1)
  other vias: 76.2,43.18
N$97  (via drill 0.6 pad 1)
  other vias: 77.47,43.18
N$98  (via drill 0.6 pad 1)
  other vias: 78.74,43.18
N$99  (via drill 0.6 pad 1)
  other vias: 80.01,43.18
N$100  (via drill 0.6 pad 1)
  other vias: 81.28,43.18
N$101  (via drill 0.6 pad 1)
  other vias: 82.55,43.18
N$102  (via drill 0.6 pad 1)
  other vias: 83.82,43.18
N$103  (via drill 0.6 pad 1)
  other vias: 85.09,43.18
N$104  (via drill 0.6 pad 1)
  other vias: 86.36,43.18
N$105  (via drill 1 pad 2.2)
  other vias: 90.17,13.97
N$106  (via drill 0.6 pad 1)
  other vias: 69.85,41.91
N$107  (via drill 0.6 pad 1)
  other vias: 71.12,41.91
N$108  (via drill 0.6 pad 1)
  other vias: 72.39,41.91
N$109  (via drill 0.6 pad 1)
  other vias: 73.66,41.91
N$110  (via drill 0.6 pad 1)
  other vias: 74.93,41.91
N$111  (via drill 0.6 pad 1)
  other vias: 76.2,41.91
N$112  (via drill 0.6 pad 1)
  other vias: 77.47,41.91
N$113  (via drill 0.6 pad 1)
  other vias: 78.74,41.91
N$114  (via drill 0.6 pad 1)
  other vias: 80.01,41.91
N$115  (via drill 0.6 pad 1)
  other vias: 81.28,41.91
N$116  (via drill 0.6 pad 1)
  other vias: 82.55,41.91
N$117  (via drill 0.6 pad 1)
  other vias: 83.82,41.91
N$118  (via drill 0.6 pad 1)
  other vias: 85.09,41.91
N$119  (via drill 0.6 pad 1)
  other vias: 86.36,41.91
N$120  (via drill 0.6 pad 1)
  other vias: 87.63,41.91
N$121  (via drill 0.6 pad 1)
  other vias: 69.85,40.64
N$122  (via drill 0.6 pad 1)
  other vias: 71.12,40.64
N$123  (via drill 0.6 pad 1)
  other vias: 72.39,40.64
N$124  (via drill 0.6 pad 1)
  other vias: 73.66,40.64
N$125  (via drill 0.6 pad 1)
  other vias: 74.93,40.64
N$126  (via drill 0.6 pad 1)
  other vias: 76.2,40.64
N$127  (via drill 0.6 pad 1)
  other vias: 77.47,40.64
N$128  (via drill 0.6 pad 1)
  other vias: 78.74,40.64
N$129  (via drill 0.6 pad 1)
  other vias: 80.01,40.64
N$130  (via drill 0.6 pad 1)
  other vias: 81.28,40.64
N$131  (via drill 0.6 pad 1)
  other vias: 82.55,40.64
N$132  (via drill 0.6 pad 1)
  other vias: 83.82,40.64
N$133  (via drill 0.6 pad 1)
  other vias: 85.09,40.64
N$134  (via drill 0.6 pad 1)
  other vias: 86.36,40.64
N$135  (via drill 0.6 pad 1)
  other vias: 87.63,40.64
N$136  (via drill 0.6 pad 1)
  other vias: 69.85,39.37
N$137  (via drill 0.6 pad 1)
  other vias: 71.12,39.37
N$138  (via drill 0.6 pad 1)
  other vias: 72.39,39.37
N$139  (via drill 0.6 pad 1)
  other vias: 73.66,39.37
N$140  (via drill 0.6 pad 1)
  other vias: 74.93,39.37
N$141  (via drill 0.6 pad 1)
  other vias: 76.2,39.37
N$142  (via drill 0.6 pad 1)
  other vias: 77.47,39.37
N$143  (via drill 0.6 pad 1)
  other vias: 78.74,39.37
N$144  (via drill 0.6 pad 1)
  other vias: 80.01,39.37
N$145  (via drill 0.6 pad 1)
  other vias: 81.28,39.37
N$146  (via drill 0.6 pad 1)
  other vias: 82.55,39.37
N$147  (via drill 0.6 pad 1)
  other vias: 83.82,39.37
N$148  (via drill 0.6 pad 1)
  other vias: 85.09,39.37
N$149  (via drill 0.6 pad 1)
  other vias: 86.36,39.37
N$150  (via drill 0.6 pad 1)
  other vias: 87.63,39.37
N$151  (via drill 0.6 pad 1)
  other vias: 69.85,38.1
N$152  (via drill 0.6 pad 1)
  other vias: 71.12,38.1
N$153  (via drill 0.6 pad 1)
  other vias: 72.39,38.1
N$154  (via drill 0.6 pad 1)
  other vias: 73.66,38.1
N$155  (via drill 0.6 pad 1)
  other vias: 74.93,38.1
N$156  (via drill 0.6 pad 1)
  other vias: 76.2,38.1
N$157  (via drill 0.6 pad 1)
  other vias: 77.47,38.1
N$158  (via drill 0.6 pad 1)
  other vias: 78.74,38.1
N$159  (via drill 0.6 pad 1)
  other vias: 80.01,38.1
N$160  (via drill 0.6 pad 1)
  other vias: 81.28,38.1
N$161  (via drill 0.6 pad 1)
  other vias: 82.55,38.1
N$162  (via drill 0.6 pad 1)
  other vias: 83.82,38.1
N$163  (via drill 0.6 pad 1)
  other vias: 85.09,38.1
N$164  (via drill 0.6 pad 1)
  other vias: 86.36,38.1
N$165  (via drill 0.6 pad 1)
  other vias: 87.63,38.1
N$166  (via drill 0.6 pad 1)
  other vias: 69.85,36.83
N$167  (via drill 0.6 pad 1)
  other vias: 71.12,36.83
N$168  (via drill 0.6 pad 1)
  other vias: 72.39,36.83
N$169  (via drill 0.6 pad 1)
  other vias: 73.66,36.83
N$170  (via drill 0.6 pad 1)
  other vias: 74.93,36.83
N$171  (via drill 0.6 pad 1)
  other vias: 76.2,36.83
N$172  (via drill 0.6 pad 1)
  other vias: 77.47,36.83
N$173  (via drill 0.6 pad 1)
  other vias: 78.74,36.83
N$174  (via drill 0.6 pad 1)
  other vias: 80.01,36.83
N$175  (via drill 0.6 pad 1)
  other vias: 81.28,36.83
N$176  (via drill 0.6 pad 1)
  other vias: 82.55,36.83
N$177  (via drill 0.6 pad 1)
  other vias: 83.82,36.83
N$178  (via drill 0.6 pad 1)
  other vias: 85.09,36.83
N$179  (via drill 0.6 pad 1)
  other vias: 86.36,36.83
N$180  (via drill 0.6 pad 1)
  other vias: 87.63,36.83
N$181  (via drill 0.6 pad 1)
  other vias: 69.85,35.56
N$182  (via drill 0.6 pad 1)
  other vias: 71.12,35.56
N$183  (via drill 0.6 pad 1)
  other vias: 72.39,35.56
N$184  (via drill 0.6 pad 1)
  other vias: 73.66,35.56
N$185  (via drill 0.6 pad 1)
  other vias: 74.93,35.56
N$186  (via drill 0.6 pad 1)
  other vias: 76.2,35.56
N$187  (via drill 0.6 pad 1)
  other vias: 77.47,35.56
N$188  (via drill 0.6 pad 1)
  other vias: 78.74,35.56
N$189  (via drill 0.6 pad 1)
  other vias: 80.01,35.56
N$190  (via drill 0.6 pad 1)
  other vias: 81.28,35.56
N$191  (via drill 0.6 pad 1)
  other vias: 82.55,35.56
N$192  (via drill 0.6 pad 1)
  other vias: 83.82,35.56
N$193  (via drill 0.6 pad 1)
  other vias: 85.09,35.56
N$194  (via drill 0.6 pad 1)
  other vias: 86.36,35.56
N$195  (via drill 0.6 pad 1)
  other vias: 87.63,35.56
N$196  (via drill 0.6 pad 1)
  other vias: 69.85,34.29
N$197  (via drill 0.6 pad 1)
  other vias: 71.12,34.29
N$198  (via drill 0.6 pad 1)
  other vias: 72.39,34.29
N$199  (via drill 0.6 pad 1)
  other vias: 73.66,34.29
N$200  (via drill 0.6 pad 1)
  other vias: 74.93,34.29
N$201  (via drill 0.6 pad 1)
  other vias: 76.2,34.29
N$202  (via drill 0.6 pad 1)
  other vias: 77.47,34.29
N$203  (via drill 0.6 pad 1)
  other vias: 78.74,34.29
N$204  (via drill 0.6 pad 1)
  other vias: 80.01,34.29
N$205  (via drill 0.6 pad 1)
  other vias: 81.28,34.29
N$206  (via drill 0.6 pad 1)
  other vias: 82.55,34.29
N$207  (via drill 0.6 pad 1)
  other vias: 83.82,34.29
N$208  (via drill 0.6 pad 1)
  other vias: 85.09,34.29
N$209  (via drill 0.6 pad 1)
  other vias: 86.36,34.29
N$210  (via drill 0.6 pad 1)
  other vias: 87.63,34.29
N$211  (via drill 0.6 pad 1)
  other vias: 69.85,33.02
N$212  (via drill 0.6 pad 1)
  other vias: 71.12,33.02
N$213  (via drill 0.6 pad 1)
  other vias: 72.39,33.02
N$214  (via drill 0.6 pad 1)
  other vias: 73.66,33.02
N$215  (via drill 0.6 pad 1)
  other vias: 74.93,33.02
N$216  (via drill 0.6 pad 1)
  other vias: 76.2,33.02
N$217  (via drill 0.6 pad 1)
  other vias: 77.47,33.02
N$218  (via drill 0.6 pad 1)
  other vias: 78.74,33.02
N$219  (via drill 0.6 pad 1)
  other vias: 80.01,33.02
N$220  (via drill 0.6 pad 1)
  other vias: 81.28,33.02
N$221  (via drill 0.6 pad 1)
  other vias: 82.55,33.02
N$222  (via drill 0.6 pad 1)
  other vias: 83.82,33.02
N$223  (via drill 0.6 pad 1)
  other vias: 85.09,33.02
N$224  (via drill 0.6 pad 1)
  other vias: 86.36,33.02
N$225  (via drill 0.6 pad 1)
  other vias: 87.63,33.02
N$226  (via drill 0.6 pad 1)
  other vias: 69.85,31.75
N$227  (via drill 0.6 pad 1)
  other vias: 71.12,31.75
N$228  (via drill 0.6 pad 1)
  other vias: 72.39,31.75
N$229  (via drill 0.6 pad 1)
  other vias: 73.66,31.75
N$230  (via drill 0.6 pad 1)
  other vias: 74.93,31.75
N$231  (via drill 0.6 pad 1)
  other vias: 76.2,31.75
N$232  (via drill 0.6 pad 1)
  other vias: 77.47,31.75
N$233  (via drill 0.6 pad 1)
  other vias: 78.74,31.75
N$234  (via drill 0.6 pad 1)
  other vias: 80.01,31.75
N$235  (via drill 0.6 pad 1)
  other vias: 81.28,31.75
N$236  (via drill 0.6 pad 1)
  other vias: 82.55,31.75
N$237  (via drill 0.6 pad 1)
  other vias: 83.82,31.75
N$238  (via drill 0.6 pad 1)
  other vias: 85.09,31.75
N$239  (via drill 0.6 pad 1)
  other vias: 86.36,31.75
N$240  (via drill 0.6 pad 1)
  other vias: 87.63,31.75
N$241  (via drill 0.6 pad 1)
  other vias: 69.85,30.48
N$242  (via drill 0.6 pad 1)
  other vias: 71.12,30.48
N$243  (via drill 0.6 pad 1)
  other vias: 72.39,30.48
N$244  (via drill 0.6 pad 1)
  other vias: 73.66,30.48
N$245  (via drill 0.6 pad 1)
  other vias: 74.93,30.48
N$246  (via drill 0.6 pad 1)
  other vias: 76.2,30.48
N$247  (via drill 0.6 pad 1)
  other vias: 77.47,30.48
N$248  (via drill 0.6 pad 1)
  other vias: 78.74,30.48
N$249  (via drill 0.6 pad 1)
  other vias: 80.01,30.48
N$250  (via drill 0.6 pad 1)
  other vias: 81.28,30.48
N$251  (via drill 0.6 pad 1)
  other vias: 82.55,30.48
N$252  (via drill 0.6 pad 1)
  other vias: 83.82,30.48
N$253  (via drill 0.6 pad 1)
  other vias: 85.09,30.48
N$254  (via drill 0.6 pad 1)
  other vias: 86.36,30.48
N$255  (via drill 0.6 pad 1)
  other vias: 87.63,30.48
N$256  (via drill 0.6 pad 1)
  other vias: 69.85,29.21
N$257  (via drill 0.6 pad 1)
  other vias: 71.12,29.21
N$258  (via drill 0.6 pad 1)
  other vias: 72.39,29.21
N$259  (via drill 0.6 pad 1)
  other vias: 73.66,29.21
N$260  (via drill 0.6 pad 1)
  other vias: 74.93,29.21
N$261  (via drill 0.6 pad 1)
  other vias: 76.2,29.21
N$262  (via drill 0.6 pad 1)
  other vias: 77.47,29.21
N$263  (via drill 0.6 pad 1)
  other vias: 78.74,29.21
N$264  (via drill 0.6 pad 1)
  other vias: 80.01,29.21
N$265  (via drill 0.6 pad 1)
  other vias: 81.28,29.21
N$266  (via drill 0.6 pad 1)
  other vias: 82.55,29.21
N$267  (via drill 0.6 pad 1)
  other vias: 83.82,29.21
N$268  (via drill 0.6 pad 1)
  other vias: 85.09,29.21
N$269  (via drill 0.6 pad 1)
  other vias: 86.36,29.21
N$270  (via drill 0.6 pad 1)
  other vias: 87.63,29.21
N$271  (via drill 0.6 pad 1)
  other vias: 69.85,27.94
N$272  (via drill 0.6 pad 1)
  other vias: 71.12,27.94
N$273  (via drill 0.6 pad 1)
  other vias: 72.39,27.94
N$274  (via drill 0.6 pad 1)
  other vias: 73.66,27.94
N$275  (via drill 0.6 pad 1)
  other vias: 74.93,27.94
N$276  (via drill 0.6 pad 1)
  other vias: 76.2,27.94
N$277  (via drill 0.6 pad 1)
  other vias: 77.47,27.94
N$278  (via drill 0.6 pad 1)
  other vias: 78.74,27.94
N$279  (via drill 0.6 pad 1)
  other vias: 80.01,27.94
N$280  (via drill 0.6 pad 1)
  other vias: 81.28,27.94
N$281  (via drill 0.6 pad 1)
  other vias: 82.55,27.94
N$282  (via drill 0.6 pad 1)
  other vias: 83.82,27.94
N$283  (via drill 0.6 pad 1)
  other vias: 85.09,27.94
N$284  (via drill 0.6 pad 1)
  other vias: 86.36,27.94
N$285  (via drill 0.6 pad 1)
  other vias: 87.63,27.94
N$286  (via drill 0.6 pad 1)
  other vias: 69.85,26.67
N$287  (via drill 0.6 pad 1)
  other vias: 71.12,26.67
N$288  (via drill 0.6 pad 1)
  other vias: 72.39,26.67
N$289  (via drill 0.6 pad 1)
  other vias: 73.66,26.67
N$290  (via drill 0.6 pad 1)
  other vias: 74.93,26.67
N$291  (via drill 0.6 pad 1)
  other vias: 76.2,26.67
N$292  (via drill 0.6 pad 1)
  other vias: 77.47,26.67
N$293  (via drill 0.6 pad 1)
  other vias: 78.74,26.67
N$294  (via drill 0.6 pad 1)
  other vias: 80.01,26.67
N$295  (via drill 0.6 pad 1)
  other vias: 81.28,26.67
N$296  (via drill 0.6 pad 1)
  other vias: 82.55,26.67
N$297  (via drill 0.6 pad 1)
  other vias: 83.82,26.67
N$298  (via drill 0.6 pad 1)
  other vias: 85.09,26.67
N$299  (via drill 0.6 pad 1)
  other vias: 86.36,26.67
N$300  (via drill 0.6 pad 1)
  other vias: 87.63,26.67
N$301  (via drill 0.6 pad 1)
  other vias: 69.85,25.4
N$302  (via drill 0.6 pad 1)
  other vias: 71.12,25.4
N$303  (via drill 0.6 pad 1)
  other vias: 72.39,25.4
N$304  (via drill 0.6 pad 1)
  other vias: 73.66,25.4
N$305  (via drill 0.6 pad 1)
  other vias: 74.93,25.4
N$306  (via drill 0.6 pad 1)
  other vias: 76.2,25.4
N$307  (via drill 0.6 pad 1)
  other vias: 77.47,25.4
N$308  (via drill 0.6 pad 1)
  other vias: 78.74,25.4
N$309  (via drill 0.6 pad 1)
  other vias: 80.01,25.4
N$310  (via drill 0.6 pad 1)
  other vias: 81.28,25.4
N$311  (via drill 0.6 pad 1)
  other vias: 82.55,25.4
N$312  (via drill 0.6 pad 1)
  other vias: 83.82,25.4
N$313  (via drill 0.6 pad 1)
  other vias: 85.09,25.4
N$314  (via drill 0.6 pad 1)
  other vias: 86.36,25.4
N$315  (via drill 0.6 pad 1)
  other vias: 87.63,25.4
N$316  (via drill 0.6 pad 1)
  other vias: 69.85,24.13
N$317  (via drill 0.6 pad 1)
  other vias: 71.12,24.13
N$318  (via drill 0.6 pad 1)
  other vias: 72.39,24.13
N$319  (via drill 0.6 pad 1)
  other vias: 73.66,24.13
N$320  (via drill 0.6 pad 1)
  other vias: 74.93,24.13
N$321  (via drill 0.6 pad 1)
  other vias: 76.2,24.13
N$322  (via drill 0.6 pad 1)
  other vias: 77.47,24.13
N$323  (via drill 0.6 pad 1)
  other vias: 78.74,24.13
N$324  (via drill 0.6 pad 1)
  other vias: 80.01,24.13
N$325  (via drill 0.6 pad 1)
  other vias: 81.28,24.13
N$326  (via drill 0.6 pad 1)
  other vias: 82.55,24.13
N$327  (via drill 0.6 pad 1)
  other vias: 83.82,24.13
N$328  (via drill 0.6 pad 1)
  other vias: 85.09,24.13
N$329  (via drill 0.6 pad 1)
  other vias: 86.36,24.13
N$330  (via drill 0.6 pad 1)
  other vias: 87.63,24.13
N$331  (via drill 1 pad 2.2)
  other vias: 69.85,21.59
N$332  (via drill 1 pad 2.2)
  other vias: 72.39,21.59
N$333  (via drill 1 pad 2.2)
  other vias: 74.93,21.59
N$334  (via drill 1 pad 2.2)
  other vias: 77.47,21.59
N$335  (via drill 1 pad 2.2)
  other vias: 80.01,21.59
N$336  (via drill 1 pad 2.2)
  other vias: 82.55,21.59
N$337  (via drill 1 pad 2.2)
  other vias: 85.09,21.59
N$338  (via drill 1 pad 2.2)
  other vias: 87.63,21.59
N$339  (via drill 1 pad 2.2)
  other vias: 87.63,19.05
N$340  (via drill 1 pad 2.2)
  other vias: 85.09,19.05
N$341  (via drill 1 pad 2.2)
  other vias: 82.55,19.05
N$342  (via drill 1 pad 2.2)
  other vias: 80.01,19.05
N$343  (via drill 1 pad 2.2)
  other vias: 77.47,19.05
N$344  (via drill 1 pad 2.2)
  other vias: 74.93,19.05
N$345  (via drill 1 pad 2.2)
  other vias: 69.85,19.05
N$346  (via drill 1 pad 2.2)
  other vias: 72.39,19.05
N$347  (via drill 1 pad 2.2)
  other vias: 69.85,16.51
N$348  (via drill 1 pad 2.2)
  other vias: 72.39,16.51
N$349  (via drill 1 pad 2.2)
  other vias: 74.93,16.51
N$350  (via drill 1 pad 2.2)
  other vias: 77.47,16.51
N$351  (via drill 1 pad 2.2)
  other vias: 80.01,16.51
N$352  (via drill 1 pad 2.2)
  other vias: 85.09,16.51
N$353  (via drill 1 pad 2.2)
  other vias: 82.55,16.51
N$354  (via drill 1 pad 2.2)
  other vias: 87.63,16.51
N$355  (via drill 1 pad 2.2)
  other vias: 90.17,16.51
N$356  (via drill 1 pad 2.2)
  other vias: 85.09,13.97
N$357  (via drill 1 pad 2.2)
  other vias: 82.55,13.97
N$358  (via drill 1 pad 2.2)
  other vias: 80.01,13.97
N$359  (via drill 1 pad 2.2)
  other vias: 77.47,13.97
N$360  (via drill 1 pad 2.2)
  other vias: 74.93,13.97
N$361  (via drill 1 pad 2.2)
  other vias: 72.39,13.97
N$362  (via drill 1 pad 2.2)
  other vias: 92.71,16.51
N$363  (via drill 1 pad 2.2)
  other vias: 92.71,13.97
N$364  (via drill 1 pad 2.2)
  other vias: 95.25,13.97
N$365  (via drill 1 pad 2.2)
  other vias: 95.25,16.51
NCHG
  Top 0.3: TP5.TP R21.1
  Top 0.4: J1.6 10.9,27.4 arc72 12.7,28.7 14.7,35.1 arc-22 TP5.TP
NCHG_M
  Top 0.2: IC1.28 45.6,42.8 arc28 44.6,43.4 arc-15 43.3,44 arc16 41.3,44.9 arc20 36.6,45.4 arc-4 29.9,45.2 arc101 28.3,43.3 arc-103 25.4,39.9 arc91 23.5,38.1 arc-86 R20.2
PSAVE
  Top 0.2: IC1.66 54.8,28.7 arc-27 55.5,27.4 arc38 56.6,25.9 arc-23 58.7,23.7 arc-53 58.8,22.9 | IC2.23 52.6,20.4 arc-87 53.8,21.6 57.9,21.6 arc65 58.8,22.9 | 58.8,22.9 R3.2
RESET1
  Top 0.2: IC3.8 65.9,64.2 arc-6 63.95,64.5 arc-79 62.4,66.25 arc89 61.75,66.8 arc-5 59.9,66.75 arc98 59.4,66.25 59.4,65 arc-58 59.3,62.7 arc62 56.9,58.05 arc-10 56.75,51.55 arc-42 IC1.17
RESET2
  Top 0.2: IC1.25 arc2 43.95,46.6 arc6 43.1,47.5 arc51 41.7,47.8 arc-11 40.3,47.6 arc77 39.5,46.9 arc-82 38.5,46.1 arc4 26,46.2 arc-75 17.8,51.8 arc52 16,53.75 arc-54 13.65,58.75 arc-38 14.7,61.6 arc-7 15.9,62.9 arc50 16.4,64.2 arc-8 16.4,65.4 arc-94 17.1,66.3 18.5,66.3
  Top 0.3: IC4.8 23.45,64.3 arc-13 20.65,64.65 arc-39 19.5,65.7 arc62 18.5,66.3
SIBK
  Top 0.3: TP9.TP R29.1
  Top 0.4: TP9.TP 13.9,21.9 arc11 13.1,19.9 arc-73 11.1,18.4 arc0 10.2,18.4 arc-1 J1.15
SIBK_M
  Top 0.2: IC1.29 47.2,40.6 arc-128 46.2,37.2 arc4 41.9,36.3 arc38 39,34.7 arc-46 35.6,33 arc-3 32.9,33 arc73 32,32.3 arc-71 28.3,28.5 arc7 25,28.2 arc82 24,26.9 arc-85 R28.2
SICL
  Top 0.3: TP10.TP R31.1
  Top 0.4: TP10.TP arc11 14.7,19.9 arc-76 10,16.4 arc1 J1.17
SICL_M
  Top 0.2: R30.2 arc-5 29.2,22.75 arc44 37.3,26.6 arc-1 39.5,28.9 arc54 40.2,30.9 arc-74 40.8,31.8 arc-16 41.5,32 arc38 42.7,32.8 IC1.45
TCK  (via drill 0.6 pad 1.5)
  Top 0.2: IC1.73 56.4,32 arc68 58.4,31.6 arc-7 60.7,32.4 arc-97 v64.1,30.2
  Bottom 0.4: X3.7 78.2,6.1 arc-37 77.6,7.7 arc78 76,10.4 arc17 72.2,11.2 arc-56 67,14.4 arc-18 63.8,22.8 arc-54 64.6,26.4 arc61 64.8,28.8 v64.1,30.2
TDI/TCLK  (via drill 0.6 pad 1.5)
  Top 0.2: IC1.71 arc10 55.6,31.4 arc19 57.5,30.2 arc24 60.1,29.7 arc-62 v63.2,27.9
  Bottom 0.4: X3.3 72.8,6.4 arc-39 72.6,6.9 arc1 72.5,8.9 arc82 71.2,10 arc-35 69.2,10.6 arc-65 62.8,25.4 v63.2,27.9
TDO/TDI  (via drill 0.6 pad 1.5)
  Top 0.2: IC1.70 55.3,31 arc6 57.8,28.8 arc59 v60.3,28.4
  Bottom 0.4: X3.1 69.5,6.6 arc-51 60.3,28.3 arc35 v60.3,28.4
TMS  (via drill 0.6 pad 1.5)
  Top 0.2: IC1.72 56.1,31.6 arc37 57.3,31 arc22 v61.3,31.2
  Bottom 0.4: v61.3,31.2 58.1,30.6 arc95 54.5,26.5 arc-14 54.7,23.2 arc53 56.9,19.2 arc-26 58.7,16.8 arc10 63.4,8.4 arc15 64.7,7 arc19 65.5,6.3 arc13 68.8,4.6 arc24 73,3.8 arc43 X3.5
V+  (via drill 0.6 pad 1.5)
  Top 0.4: C8.1 86.1,66.83 | C8.1 arc-23 C6.2 arc-81 86.9,69.7 arc23 D1.A | IC3.4 67.6,66.83 arc-61 v66,67.8 | IC3.33 82.8,66.83 arc39 83.3,67 arc-73 C8.1 | IC4.4 24.62,66.88 arc-75 v23.3,67.9 | IC4.33 40.27,66.88 arc56 40.7,67.1 arc-44 41.3,67.5 arc-43 C15.1 43.5,69 arc-45 C13.2 arc-37 44.2,69.7 arc-9 D3.A arc126 47.8,71.1 arc-36 C12.+ | IC2.22 53.8,16.9 arc82 58.3,11.5 arc-13 61.8,10.5 arc-137 61.7,5.6 arc-25 C4.1 arc-89 56.8,3.3 arc-13 54.2,3 38.4,3 arc-20 32.1,4.1 arc-48 30.9,5 arc68 27.8,6.7 23.2,6.7 arc-37 20.2,7.7 arc22 17.6,12.2 17.57,15.12 v17.8,18.4
  Top 0.406: D1.A arc-5 90.4,69.7 arc109 91,70.7 arc-12 C5.+
  Top 0.5: J1.19 16.3,14.4 arc-8 17.57,15.12
  Top 0.6: 3.7,67.3 J4.1
  Top 1: J4.1 arc-103 2.3,68.7 arc-84 X2.2 arc16 5.9,71.7 arc18 19.2,71.1 arc-88 v23.3,67.9 | 3.7,67.3 arc97 1.5,64.8 arc-8 2.2,53 arc43 IC5.2
  Bottom 0.4: v17.8,18.4 17.8,18.6
  Bottom 0.6: 46.3,73.5 C12.+
  Bottom 1: C5.+ arc3 68.6,73.3 arc117 v66,67.8 arc-26 65.5,69 arc141 57.3,70.4 arc-99 51.9,69.3 arc-8 48.2,72.6 C12.+ | 46.3,73.5 26.8,73.4 arc114 v23.3,67.9 | IC5.2 5.8,40.5 arc46 v17.8,18.4
  other vias: 16.2,12.1 17.7,12.1 19.2,12.1 19.2,10.6 17.7,10.6 16.2,10.6 16.2,9.1 17.7,9.1 19.2,9.1
  pour Top (rank 2): 21.2,7.5 21.2,17.3 arc96 17.3,19.8 arc55 16,19 arc-50 14.1,16.3 arc64 12.4,13.1 arc-87 11,12.6 arc-5 8.5,12.5 arc96 7.5,11.1 7.5,5.9 arc90 9.1,4.3 12.6,2.4 arc49 14.2,4.9 arc-55 15.9,6.6 arc33
  pour Bottom (rank 2): 21.3,5.3 21.2,15.4 arc90 19.9,16.7 10.6,16.7 arc90 9.3,15.4 9.3,15 arc90 10.6,13.8 12.1,13.8 arc-90 13.3,12.5 13.3,12.3 arc-90 12,11 7.3,11 arc90 4.9,8.6 4.9,4.9 arc90 7.5,2.3 18.1,2.3 arc90
VOUT+
  Top 0.5: IC5.6 15.9,45.9 arc24 R37.1